# EAGLE design zcu-sync-control (EAGLE 7.4.0)
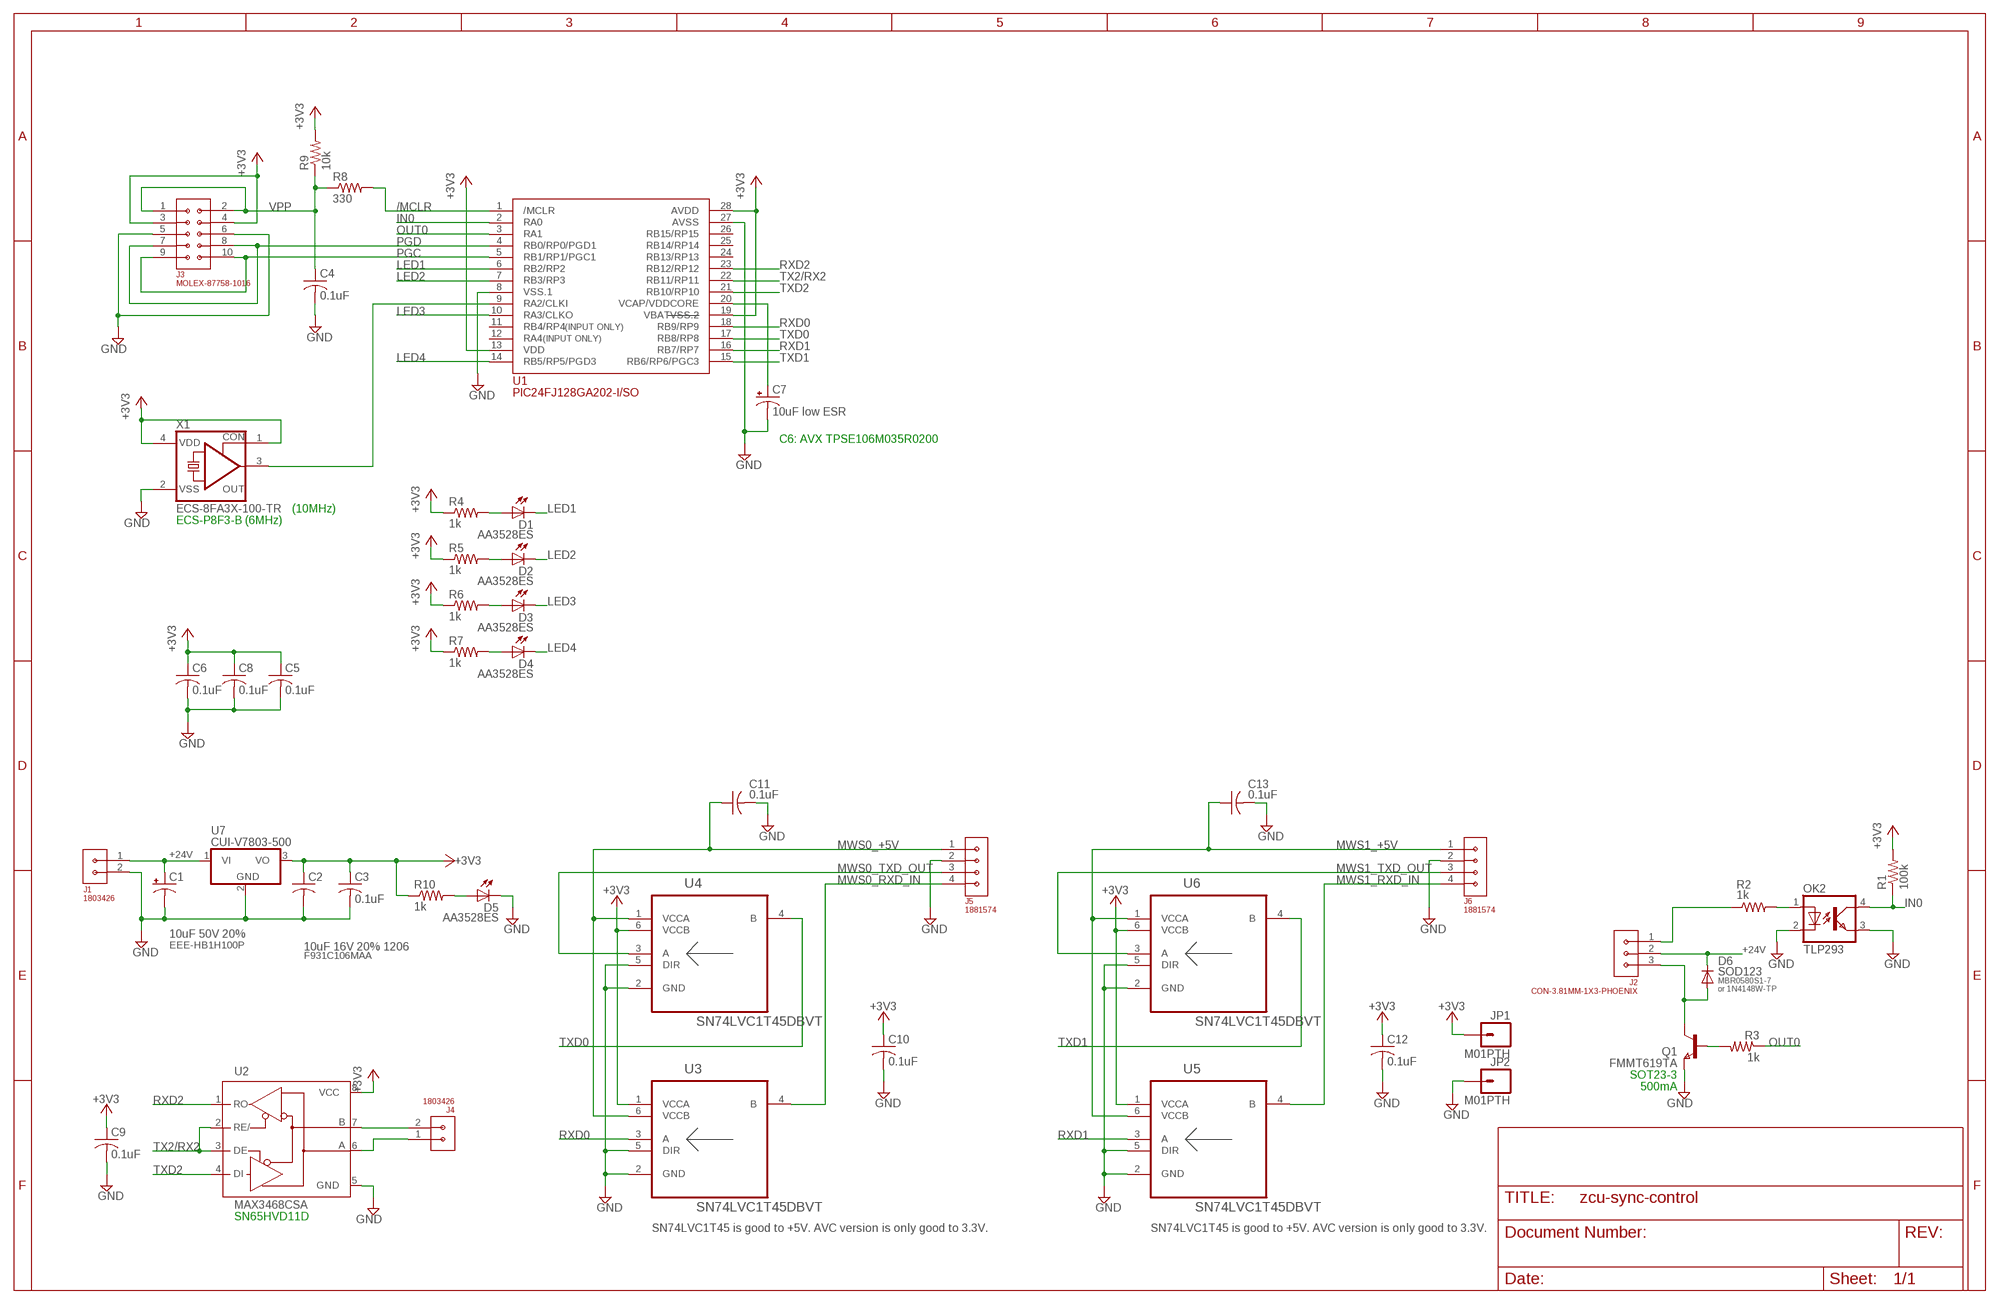
[diagram p0: schematic, sheet 1]

## Parts
C1  10uF 50V 20%  CPOL-USD  [PANASONIC_D]
C2  10uF 16V 20% 1206  C-USC1206  [C1206]
C3  0.1uF  C-USC1206  [C1206]
C4  0.1uF  C-USC1206  [C1206]
C5  0.1uF  C-USC1206  [C1206]
C6  0.1uF  C-USC1206  [C1206]
C7  10uF low ESR  CPOL-USD/7343-31R  [D/7343-31R]
C8  0.1uF  C-USC1206  [C1206]
C9  0.1uF  C-USC1206  [C1206]
C10  0.1uF  C-USC1206  [C1206]
C11  0.1uF  C-USC1206  [C1206]
C12  0.1uF  C-USC1206  [C1206]
C13  0.1uF  C-USC1206  [C1206]
D1  AA3528ES  LEDKA-3528ASYC  [KA-3528ASYC]
D2  AA3528ES  LEDKA-3528ASYC  [KA-3528ASYC]
D3  AA3528ES  LEDKA-3528ASYC  [KA-3528ASYC]
D4  AA3528ES  LEDKA-3528ASYC  [KA-3528ASYC]
D5  AA3528ES  LEDKA-3528ASYC  [KA-3528ASYC]
D6  1N4148W-TP  DIODE-SOD123  [SOD123]
J1  1803426  CON-3.81MM-1X2-PHOENIX-1803426  [CON-PHOENIX-1803426-3.81-1X2]
J2  CON-3.81MM-1X3-PHOENIX  [CON-PHOENIX-3.81-1X3]
J3  MOLEX-87758-1016  CON-2MM-2X5-MOLEX-87758-1016  [CON-2MM-2X5]
J4  1803426  CON-3.81MM-1X2-PHOENIX-1803426  [CON-PHOENIX-1803426-3.81-1X2]
J5  1881574  CON-2.5MM-1X4-PHOENIX-1881574  [CON-2.5MM-1X4-PHOENIX-1881574]
J6  1881574  CON-2.5MM-1X4-PHOENIX-1881574  [CON-2.5MM-1X4-PHOENIX-1881574]
JP1  M01PTH  [1X01]
JP2  M01PTH  [1X01]
OK2  TLP293  TLP283  [MINI-FLAT-4]
Q1  FMMT619TA  NPNSOT23  [SOT-23]
R1  100k  R-US_R1206  [R1206]
R2  1k  R-US_R1206  [R1206]
R3  1k  R-US_R1206  [R1206]
R4  1k  R-US_R1206  [R1206]
R5  1k  R-US_R1206  [R1206]
R6  1k  R-US_R1206  [R1206]
R7  1k  R-US_R1206  [R1206]
R8  330  R-US_R1206  [R1206]
R9  10k  R-US_R1206  [R1206]
R10  1k  R-US_R1206  [R1206]
U1  PIC24FJ128GA202-I/SO  PIC24HJ128GP202-I/SO  [SO28W]
U2  MAX3468CSA  [SO08]
U3  SN74LVC1T45DBVT  SN74AVC1T45DBVT  [SOT95P280X145-6N]
U4  SN74LVC1T45DBVT  SN74AVC1T45DBVT  [SOT95P280X145-6N]
U5  SN74LVC1T45DBVT  SN74AVC1T45DBVT  [SOT95P280X145-6N]
U6  SN74LVC1T45DBVT  SN74AVC1T45DBVT  [SOT95P280X145-6N]
U7  CUI-V7803-500  [CUI-78XX-500]
X1  ECS-8FA3X-100-TR  CRYSTAL_RES-1100S  [1100S]

## Nets
+3V3: C2.1 C3.1 C5.1 C6.1 C8.1 C9.1 C10.1 C12.1 J3.3 J3.4 JP1.1 R1.2 R4.1 R5.1 R6.1 R7.1 R9.2 R10.1 U1.13(VDD) U1.19(VSS.2) U1.28(AVDD) U2.8(VCC) U3.1(VCCA) U4.6(VCCB) U5.1(VCCA) U6.6(VCCB) U7.3(VO) X1.1(CON) X1.4(VDD)
+24V: C1.+ D6.C J1.1 J2.2 U7.1(VI)
/MCLR: R8.2 U1.1(/MCLR)
D+: J4.1 U2.6(A)
D-: J4.2 U2.7(B)
GND: C1.- C2.2 C3.2 C4.2 C5.2 C6.2 C7.- C8.2 C9.2 C10.2 C11.2 C12.2 C13.2 D5.C J1.2 J3.5 J3.6 J5.2 J6.2 JP2.1 OK2.2(C) OK2.3(EMIT) Q1.2(E) U1.8(VSS.1) U1.27(AVSS) U2.5(GND) U3.2(GND) U3.5(DIR) U4.2(GND) U4.5(DIR) U5.2(GND) U5.5(DIR) U6.2(GND) U6.5(DIR) U7.2(GND) X1.2(VSS)
IN0: OK2.4(COL) R1.1 U1.2(RA0)
LED1: D1.C U1.6(RB2/RP2)
LED2: D2.C U1.7(RB3/RP3)
LED3: D3.C U1.10(RA3/CLKO)
LED4: D4.C U1.14(RB5/RP5/PGD3)
MWS0_+5V: C11.1 J5.1 U3.6(VCCB) U4.1(VCCA)
MWS0_RXD_IN: J5.4 U3.4(B)
MWS0_TXD_OUT: J5.3 U4.3(A)
MWS1_+5V: C13.1 J6.1 U5.6(VCCB) U6.1(VCCA)
MWS1_RXD_IN: J6.4 U5.4(B)
MWS1_TXD_OUT: J6.3 U6.3(A)
N$1: U1.9(RA2/CLKI) X1.3(OUT)
N$3: D1.A R4.2
N$4: C7.+ U1.20(VCAP/VDDCORE)
N$6: D2.A R5.2
N$8: D3.A R6.2
N$10: OK2.1(A) R2.2
N$11: D4.A R7.2
N$13: J2.1 R2.1
N$14: D6.A J2.3 Q1.1(C)
N$16: Q1.3(B) R3.2
N$31: D5.A R10.2
OUT0: R3.1 U1.3(RA1)
PGC: J3.9 J3.10 U1.5(RB1/RP1/PGC1)
PGD: J3.7 J3.8 U1.4(RB0/RP0/PGD1)
RXD0: U1.18(RB9/RP9) U3.3(A)
RXD1: U1.16(RB7/RP7) U5.3(A)
RXD2: U1.23(RB12/RP12) U2.1(RO)
TX2/RX2: U1.22(RB11/RP11) U2.2(RE/) U2.3(DE)
TXD0: U1.17(RB8/RP8) U4.4(B)
TXD1: U1.15(RB6/RP6/PGC3) U6.4(B)
TXD2: U1.21(RB10/RP10) U2.4(DI)
VPP: C4.1 J3.1 J3.2 R8.1 R9.1
Unconnected: U1.11(RB4/RP4) U1.12(RA4) U1.24(RB13/RP13) U1.25(RB14/RP14) U1.26(RB15/RP15)

## Notes on the sheet
- VBAT
- (INPUT ONLY)
- (INPUT ONLY)
- C6: AVX TPSE106M035R0200
- (10MHz)
- ECS-P8F3-B (6MHz)
- EEE-HB1H100P
- F931C106MAA
- SOD123
- MBR0580S1-7
- or 1N4148W-TP
- SOT23-3
- 500mA
- SN65HVD11D
- SN74LVC1T45 is good to +5V. AVC version is only good to 3.3V. | SN74LVC1T45 is good to +5V. AVC version is only good to 3.3V.

## Library data of the parts
C1 C7 = rcl:CPOL-US: POLARIZED CAPACITOR, American symbol
C2-C6 C8-C13 = rcl:C-US: CAPACITOR, American symbol
D1-D5 = led:LED: LED OSRAM: - CHIPLED LG R971, LG N971, LY N971, LG Q971, LY Q971, LO R971, LY R971 LH N974, LH R974 LS Q976, LO Q976, LY Q976 LO Q996 - Hyper CHIPLED LW Q18S LB Q993, LB Q99A, LB R99A - SideLED LS A670, LO A670, LY A670, LG A670, LP A670 LB A673, LV A673, LT A673, LW A673 LH A674 LY A675 LS A676, LA A676, LO A676, LY A676, LW A676 LS A679, LY A679, LG A679 - Hyper Micro SIDELED® LS Y876, LA Y876, LO Y876, LY Y876 LT Y87S - SmartLED LW L88C, LW L88S LB L89C, LB L89S, LG L890 LS L89K, LO L89K, LY L89K LS L896, LA L896, LO L896, LY L896 - TOPLED LS T670, LO T670, LY T670, LG T670, LP T670 LSG T670, LSP T670, LSY T670, LOP T670, LYG T670 LG T671, LOG T671, LSG T671 LB T673, LV T673, LT T673, LW T673 LH T674 LS T676, LA T676, LO T676, LY T676, LB T676, LH T676, LSB T676, LW T676 LB T67C, LV T67C, LT T67C, LS T67K, LO T67K, LY T67K, LW E67C LS E67B, LA E67B, LO E67B, LY E67B, LB E67C, LV E67C, LT E67C LW T67C LS T679, LY T679, LG T679 LS T770, LO T770, LY T770, LG T770, LP T770 LB T773, LV T773, LT T773, LW T773 LH T774 LS E675, LA E675, LY E675, LS T675 LS T776, LA T776, LO T776, LY T776, LB T776 LHGB T686 LT T68C, LB T68C - Hyper Mini TOPLED® LB M676 - Mini TOPLED Santana® LG M470 LS M47K, LO M47K, LY M47K Source: http://www.osram.convergy.de LUXEON: - LUMILED® LXK2-PW12-R00, LXK2-PW12-S00, LXK2-PW14-U00, LXK2-PW14-V00 LXK2-PM12-R00, LXK2-PM12-S00, LXK2-PM14-U00 LXK2-PE12-Q00, LXK2-PE12-R00, LXK2-PE12-S00, LXK2-PE14-T00, LXK2-PE14-U00 LXK2-PB12-K00, LXK2-PB12-L00, LXK2-PB12-M00, LXK2-PB14-N00, LXK2-PB14-P00, LXK2-PB14-Q00 LXK2-PR12-L00, LXK2-PR12-M00, LXK2-PR14-Q00, LXK2-PR14-R00 LXK2-PD12-Q00, LXK2-PD12-R00, LXK2-PD12-S00 LXK2-PH12-R00, LXK2-PH12-S00 LXK2-PL12-P00, LXK2-PL12-Q00, LXK2-PL12-R00 Source: www.luxeon.com KINGBRIGHT: KA-3528ASYC Source: www.kingbright.com
D6 = diode:DIODE-: DIODE
J1 J4 = 0GlenConnectors:CON-3.81MM-1X2-PHOENIX-1803426
J2 = 0GlenConnectors:CON-3.81MM-1X3-PHOENIX
J3 = 0GlenConnectors:CON-2MM-2X5-MOLEX-87758-1016
J5 J6 = 0GlenConnectors:CON-2.5MM-1X4-PHOENIX-1881574
JP1 JP2 = SparkFun:M01: Header 1 Standard 1-pin 0.1" header. Use with straight break away headers (SKU : PRT-00116), right angle break away headers (PRT-00553), swiss pins (PRT-00743), machine pins (PRT-00117), and female headers (PRT-00115).
OK2 = optocoupler:TLP283: TOSHIBA PHOTOCOUPLER GaAs IRED & PHOTO-TRANSISTOR Source: http://www.semicon.toshiba.co.jp/td/en/Opto/Photocoupler/en_20050928_TLP283_datasheet.pdf; OC_FARNELL: unknown; OC_NEWARK: unknown
Q1 = zetex:NPNSOT23: NPN TRANSISTOR; MPN: DSS20201L-7; OC_FARNELL: 1710688; OC_NEWARK: 25R4555
R1-R10 = rcl:R-US_: RESISTOR, American symbol
U1 = GlenPartsLibrary:PIC24HJ128GP202-I/SO
U2 = maxim:MAX34*: +5V, Fail-Safe, 40Mbps, Profibus RS-485/RS-422 Transceivers Source: MAX3465-MAX3469.pdf; MPN: MAX3468CSA+; OC_FARNELL: unknown; OC_NEWARK: 76K6721
U3-U6 = Texas Instruments_By_element14_Batch_1:SN74AVC1T45DBVT: SINGLE-BIT DUAL-SUPPLY BUS TRANSCEIVER WITH CONFIGURABLE VOLTAGE TRANSLATION AND 3-STATE OUTPUTS; MPN: SN74AVC1T45DBVT; OC_FARNELL: 1053519; OC_NEWARK: 21J8968; PACKAGE: SOT-23-6; SUPPLIER: TEXAS INSTRUMENTS
U7 = GlenPartsLibrary:CUI-V7803-500
X1 = crystal:CRYSTAL_RES-: CRYSTAL RESONATOR; OC_FARNELL: unknown; OC_NEWARK: unknown

## Board
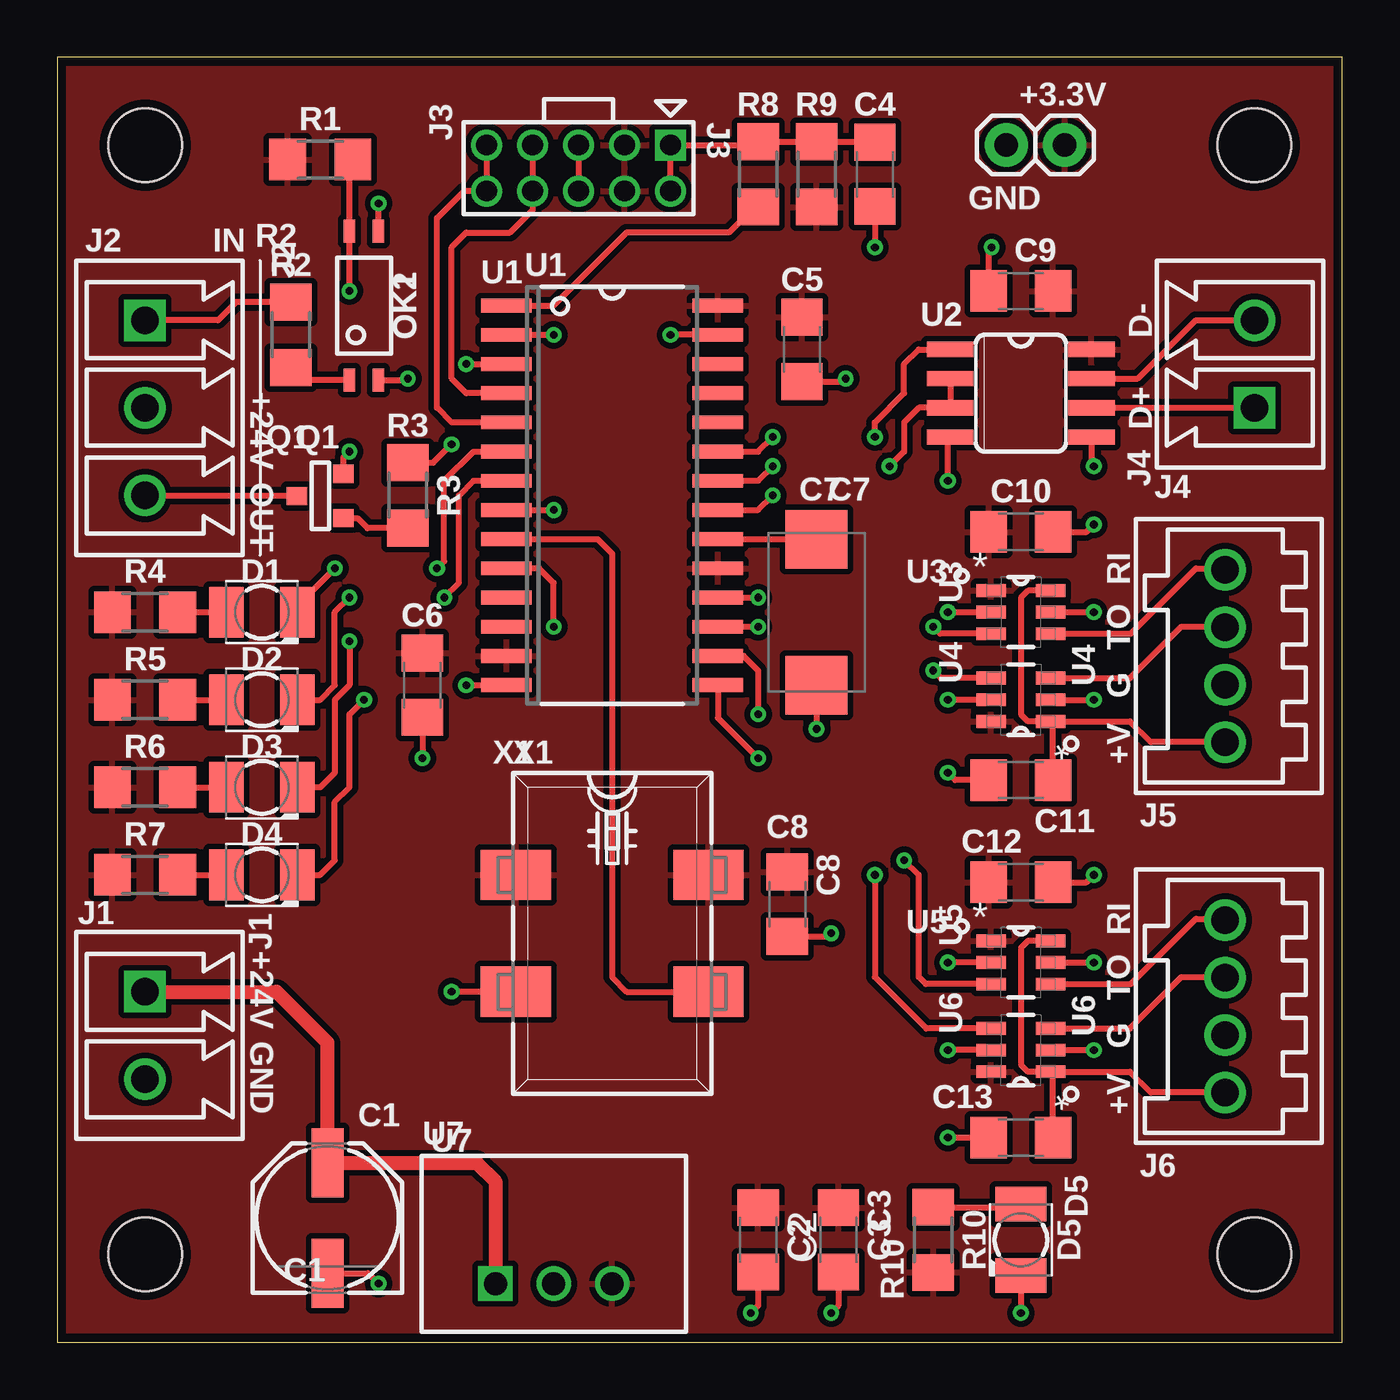
[diagram p1: board, top side]
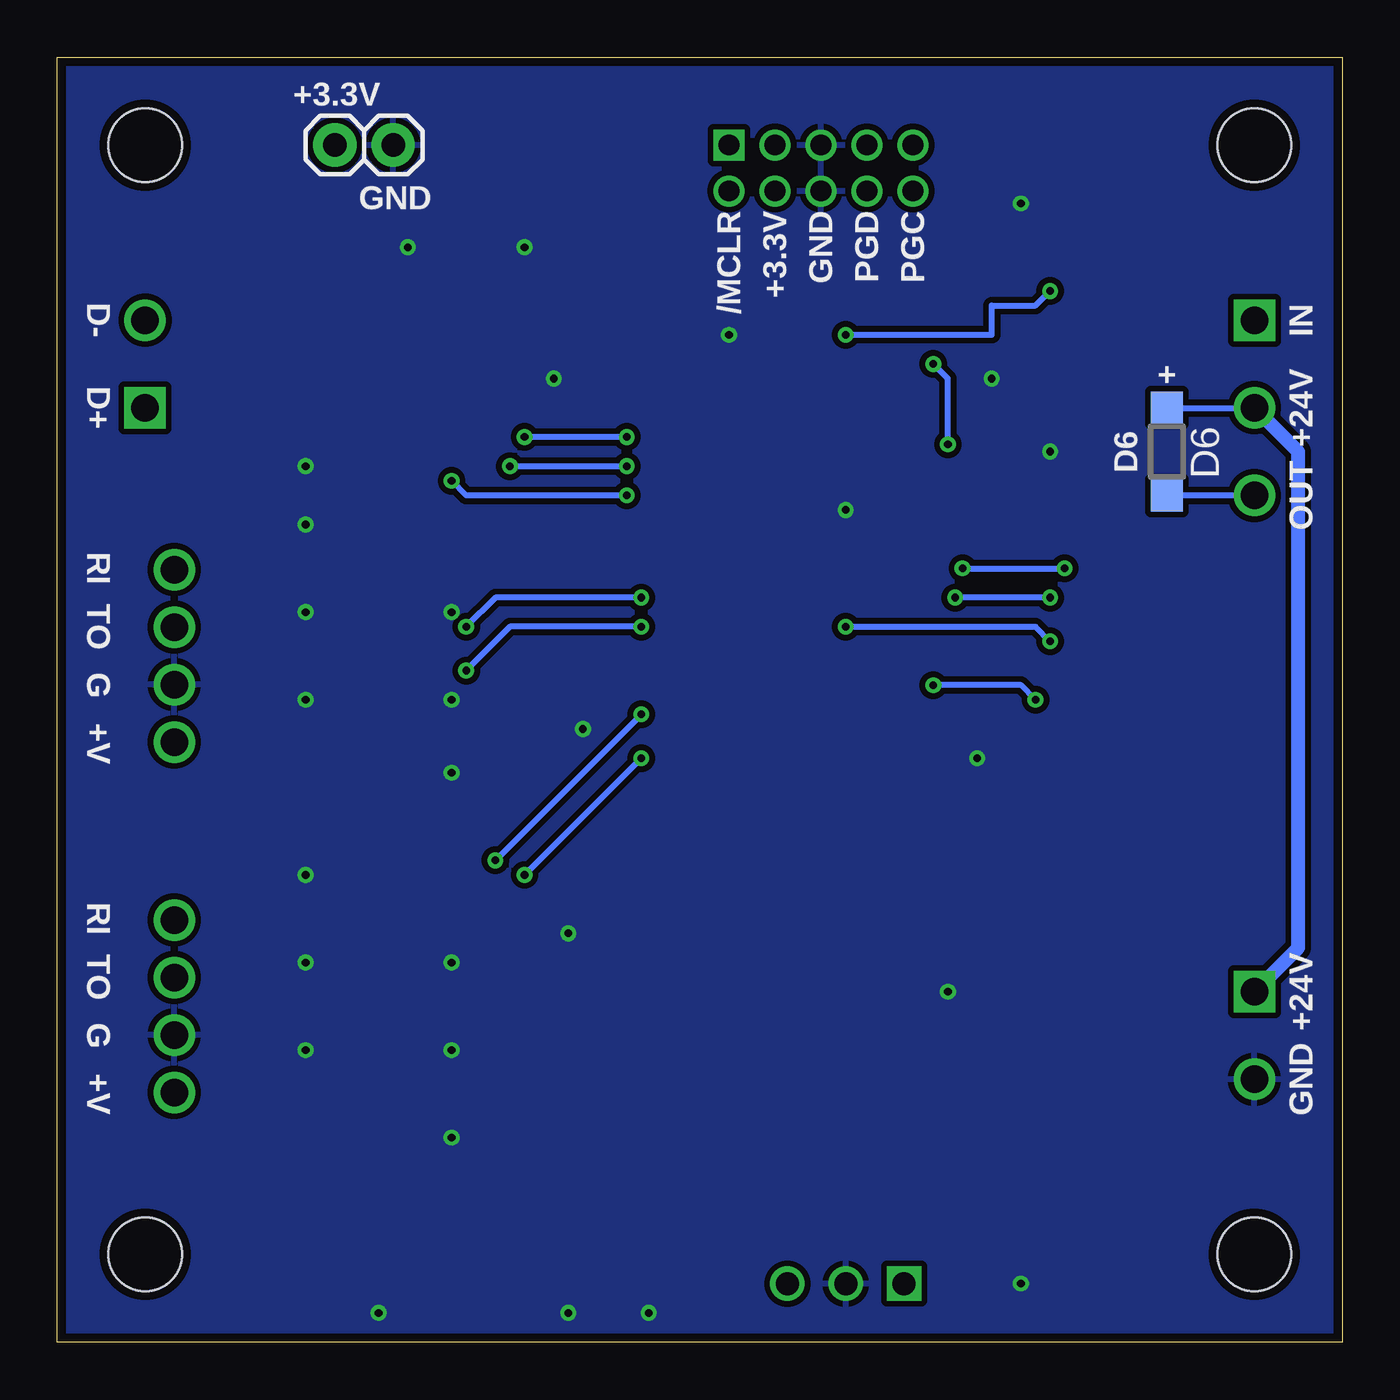
[diagram p2: board, bottom side, seen from below]

Size 55.88 x 55.88 mm. Coordinates in mm from the lower left corner, seen from the top.
Outline: 0,0 55.88,0 55.88,55.88 0,55.88 0,0
Copper layers (1*16): Top 0.0356mm / dielectric 1.5011mm / Bottom 0.0356mm
Design rules "oshpark-2layer": minimum track width 6mil, minimum drill 13mil, track to track 6mil, track to pad 6mil, pad to pad 6mil, via to via 6mil, smd to smd 6mil, copper to edge 15mil, drill to drill 6mil, minimum pad ring 7mil, minimum via ring 7mil, stop-mask expansion 2.5mil, vias tented up to drill 0mil, thermal gap 10mil
Holes 3.2 mm at 3.81,3.81 52.07,3.81 3.81,52.07 52.07,52.07

### Footprints (pad centres in the part's own frame; a part is rotated, then mirrored left to right if it is on the bottom)
PANASONIC_D = smd 3 x 1.4: + 2.4,0; - -2.4,0
C1206 = smd 1.6 x 1.8: 1 -1.4,0; 2 1.4,0
D/7343-31R = smd 2.55 x 2.7: + 3.175,0; - -3.175,0
KA-3528ASYC = smd 1.5 x 2.2: A -1.55,0; C 1.55,0
SOD123 = smd 1.4 x 1.4: A 1.9,0; C -1.9,0
CON-PHOENIX-1803426-3.81-1X2 = drill 1.2 square: 1 0,0 | drill 1.2: 2 3.81,0
CON-PHOENIX-3.81-1X3 = drill 1.2 square: 1 0,0 | drill 1.2: 2 3.81,0; 3 7.62,0
CON-2MM-2X5 = drill 0.9 pad 1.27 square: 1 0,0 | drill 0.9 pad 1.27: 2 2,0; 3 0,-2; 4 2,-2; 5 0,-4; 6 2,-4; 7 0,-6; 8 2,-6; 9 0,-8; 10 2,-8
CON-2.5MM-1X4-PHOENIX-1881574 = drill 1.2: 1 -3.75,0; 2 -1.25,0; 3 1.25,0; 4 3.75,0
1X01 = drill 1.016 pad 1.88: 1 0,0
MINI-FLAT-4 = smd 1 x 0.5: 1 -3.24,0.635; 2 -3.24,-0.635; 3 3.24,-0.635; 4 3.24,0.635
SOT-23 = smd 0.787 x 0.889: 1 0.025,-1.016; 2 -0.94,1.016; 3 0.991,1.016
R1206 = smd 1.6 x 1.803: 1 -1.422,0; 2 1.422,0
SO28W = smd 0.6 x 2.2: 1 -8.255,-4.6; 2 -6.985,-4.6; 3 -5.715,-4.6; 4 -4.445,-4.6; 5 -3.175,-4.6; 6 -1.905,-4.6; 7 -0.635,-4.6; 8 0.635,-4.6; 9 1.905,-4.6; 10 3.175,-4.6; 11 4.445,-4.6; 12 5.715,-4.6; 13 6.985,-4.6; 14 8.255,-4.6; 15 8.255,4.6; 16 6.985,4.6; 17 5.715,4.6; 18 4.445,4.6; 19 3.175,4.6; 20 1.905,4.6; 21 0.635,4.6; 22 -0.635,4.6; 23 -1.905,4.6; 24 -3.175,4.6; 25 -4.445,4.6; 26 -5.715,4.6; 27 -6.985,4.6; 28 -8.255,4.6
SO08 = smd 0.66 x 2.032: 1 -1.905,-3.073; 2 -0.635,-3.073; 3 0.635,-3.073; 4 1.905,-3.073; 5 1.905,3.073; 6 0.635,3.073; 7 -0.635,3.073; 8 -1.905,3.073
SOT95P280X145-6N = smd 1.27 x 0.559: 1 -1.295,0.94; 2 -1.295,0; 3 -1.295,-0.94; 4 1.295,-0.94; 5 1.295,0; 6 1.295,0.94
CUI-78XX-500 = drill 1 square: 1 0,0 | drill 1: 2 2.54,0; 3 5.08,0
1100S = smd 2.184 x 3.048: 1 -2.54,-4.191; 2 2.54,-4.191; 3 2.54,4.191; 4 -2.54,4.191

### Placement (x,y rotation side)
C1  11.75,5.4 90 top
C2  30.48,4.45 270 top
C3  33.97,4.45 270 top
C4  35.56,50.8 270 top
C5  32.38,43.18 270 top
C6  15.88,28.57 270 top
C7  33.02,31.75 90 top
C8  31.75,19.05 270 top
C9  41.91,45.72 180 top
C10  41.91,35.24 0 top
C11  41.91,24.45 180 top
C12  41.91,20 0 top
C13  41.91,8.89 180 top
D1  8.89,31.75 0 top
D2  8.89,27.94 0 top
D3  8.89,24.13 0 top
D4  8.89,20.32 0 top
D5  41.91,4.45 270 top
D6  7.62,38.73 270 bottom
J1  3.81,15.24 270 top
J2  3.81,44.45 270 top
J3  26.67,52.07 270 top
J4  52.07,40.64 90 top
J5  50.8,29.84 90 top
J6  50.8,14.61 90 top
JP1  43.81,52.07 0 top
JP2  41.27,52.07 0 top
OK2  13.34,45.09 90 top
Q1  11.43,36.83 270 top
R1  11.43,51.44 180 top
R2  10.16,43.81 270 top
R3  15.24,36.83 270 top
R4  3.81,31.75 0 top
R5  3.81,27.94 0 top
R6  3.81,24.13 0 top
R7  3.81,20.32 0 top
R8  30.48,50.8 270 top
R9  33.02,50.8 270 top
R10  38.1,4.45 90 top
U1  24.13,36.83 270 top
U2  41.91,41.27 270 top
U3  41.91,31.75 0 top
U4  41.91,27.94 180 top
U5  41.91,16.51 0 top
U6  41.91,12.7 180 top
U7  19.05,2.54 0 top
X1  24.13,17.78 270 top

### Tracks (layer width: path | path; a pad name or v marks a point on that pad's centre or on a via)
+3V3
  pour Top (isolate 0.254): 0,55.88 0,0 55.88,0 55.88,55.88
+24V
  Top 0.61: J1.1 9.53,15.24 11.75,13.02 C1.+ 18.24,7.8 19.05,6.99 U7.1
  Bottom 0.254: D6.C J2.2
  Bottom 0.61: J1.1 1.91,17.14 1.91,38.73 J2.2
/MCLR
  Top 0.254: U1.1 21.59,45.09 24.77,48.26 29.21,48.26 30.33,49.38 R8.2
D+
  Top 0.254: U2.6 J4.1
D-
  Top 0.254: U2.7 46.99,41.91 49.53,44.45 J4.2
GND  (via drill 0.33)
  Top 0.254: C10.2 44.77,35.24 v45.09,35.56 | U2.5 44.98,38.2 v45.09,38.1 | C9.2 40.51,47.49 v40.64,47.62 | C12.2 44.77,20 v45.09,20.32 | C11.2 39.05,24.45 v38.73,24.77 | U4.5 v38.73,27.94 | U4.2 v45.09,27.94 | U3.5 v45.09,31.75 | v38.73,31.75 U3.2 | C13.2 v38.73,8.89 | U6.5 v38.73,12.7 | U6.2 v45.09,12.7 | U5.5 v45.09,16.51 | U5.2 v38.73,16.51 | J3.5 J3.6 | C4.2 v35.56,47.62 | U1.27 v26.67,43.81 | C7.- v33.02,26.67 | U1.8 v21.59,36.2 | C5.2 34.16,41.78 v34.29,41.91 | X1.2 v17.14,15.24 | C8.2 33.52,17.65 v33.66,17.78 | C6.2 v15.88,25.4 | C1.- 13.51,3 v13.97,2.54 | C3.2 33.97,1.59 v33.66,1.27 | D5.C v41.91,1.27 | OK2.3 v13.97,49.53 | Q1.2 12.45,38.48 v12.7,38.73 | OK2.2 15.18,41.84 v15.24,41.91 | C2.2 30.48,1.59 v30.16,1.27
  pour Bottom (isolate 0.254): 0,55.88 55.88,55.88 55.88,0 0,0
IN0  (via drill 0.33)
  Top 0.254: R1.1 12.7,51.28 OK2.4 v12.7,45.72 | U1.2 v21.59,43.81
  Bottom 0.254: v21.59,43.81 15.24,43.81 15.24,45.09 13.34,45.09 v12.7,45.72
LED1  (via drill 0.33)
  Top 0.254: D1.C 10.44,32.03 v12.06,33.66 | v16.51,33.66 16.83,33.97 16.83,37.47 18.1,38.73 U1.6
  Bottom 0.254: v16.51,33.66 v12.06,33.66
LED2  (via drill 0.33)
  Top 0.254: D2.C 11.43,27.94 12.06,28.57 12.06,31.75 v12.7,32.38 | v16.83,32.38 17.46,33.02 17.46,36.83 18.1,37.47 U1.7
  Bottom 0.254: v12.7,32.38 v16.83,32.38
LED3  (via drill 0.33)
  Top 0.254: v12.7,30.48 12.7,28.57 12.06,27.94 12.06,24.77 11.43,24.13 D3.C | v21.59,31.11 21.59,33.02 20.95,33.66 U1.10
  Bottom 0.254: v21.59,31.11 13.34,31.11 v12.7,30.48
LED4  (via drill 0.33)
  Top 0.254: D4.C 11.43,20.32 12.06,20.95 12.06,23.5 12.7,24.13 12.7,27.3 v13.34,27.94 | v17.78,28.57 U1.14
  Bottom 0.254: v13.34,27.94 13.97,28.57 v17.78,28.57
MWS0_+5V
  Top 0.254: C11.1 43.31,26.9 U4.1 | U4.1 42.22,27 41.91,27.3 41.91,32.38 42.22,32.69 U3.6 | U4.1 46.66,27 47.56,26.09 J5.1
MWS0_RXD_IN
  Top 0.254: U3.4 46.69,30.81 49.53,33.66 50.74,33.66 J5.4
MWS0_TXD_OUT
  Top 0.254: U4.3 46.66,28.88 48.9,31.11 50.78,31.11 J5.3
MWS1_+5V
  Top 0.254: C13.1 43.31,11.66 U6.1 | U6.1 42.22,11.76 41.91,12.06 41.91,17.14 42.22,17.45 U5.6 | U6.1 46.66,11.76 47.56,10.86 J6.1
MWS1_RXD_IN
  Top 0.254: U5.4 46.69,15.57 49.53,18.41 50.74,18.41 J6.4
MWS1_TXD_OUT
  Top 0.254: U6.3 46.66,13.64 48.9,15.88 50.78,15.88 J6.3
N$1
  Top 0.254: U1.9 23.5,34.92 24.13,34.29 24.13,15.88 24.77,15.24 X1.3
N$3
  Top 0.254: R4.2 D1.A
N$4
  Top 0.254: U1.20 C7.+
N$6
  Top 0.254: R5.2 D2.A
N$8
  Top 0.254: R6.2 D3.A
N$10
  Top 0.254: OK2.1 10.71,41.84 R2.2
N$11
  Top 0.254: R7.2 D4.A
N$13
  Top 0.254: R2.1 7.77,45.24 6.99,44.45 J2.1
N$14
  Top 0.254: J2.3 10.39,36.83 Q1.1
  Bottom 0.254: J2.3 D6.A
N$16
  Top 0.254: Q1.3 13.06,35.84 13.49,35.41 R3.2
N$31
  Top 0.254: R10.2 41.78,5.87 D5.A
OUT0  (via drill 0.33)
  Top 0.254: R3.1 16.34,38.25 v17.14,39.05 | v17.78,42.55 U1.3
  Bottom 0.254: v17.14,39.05 17.14,41.91 v17.78,42.55
PGC
  Top 0.254: U1.5 17.14,40.01 16.51,40.64 16.51,48.9 17.68,50.07 J3.10 J3.9
PGD
  Top 0.254: U1.4 17.78,41.27 17.14,41.91 17.14,47.62 17.78,48.26 19.68,48.26 20.67,49.24 J3.8 J3.7
RXD0  (via drill 0.33)
  Top 0.254: U1.18 v30.48,32.38 | U3.3 38.41,30.81 v38.1,31.11
  Bottom 0.254: v30.48,32.38 36.83,32.38 v38.1,31.11
RXD1  (via drill 0.33)
  Top 0.254: U5.3 37.77,15.57 37.47,15.88 37.47,20.32 v36.83,20.95 | U1.16 29.84,29.84 30.48,29.21 v30.48,27.3
  Bottom 0.254: v36.83,20.95 v30.48,27.3
RXD2  (via drill 0.33)
  Top 0.254: U1.23 30.48,38.73 v31.11,39.37 | v35.56,39.37 35.56,40.01 36.83,41.27 36.83,42.55 37.47,43.18 U2.1
  Bottom 0.254: v31.11,39.37 v35.56,39.37
TX2/RX2  (via drill 0.33)
  Top 0.254: U2.2 U2.3 37.47,40.64 36.83,40.01 36.83,38.73 v36.2,38.1 | U1.22 30.48,37.47 v31.11,38.1
  Bottom 0.254: v36.2,38.1 v31.11,38.1
TXD0  (via drill 0.33)
  Top 0.254: U1.17 v30.48,31.11 | U4.4 38.43,28.88 v38.1,29.21
  Bottom 0.254: v30.48,31.11 36.2,31.11 v38.1,29.21
TXD1  (via drill 0.33)
  Top 0.254: U1.15 28.73,27.15 v30.48,25.4 | v35.56,20.32 35.56,15.88 37.8,13.64 U6.4
  Bottom 0.254: v30.48,25.4 v35.56,20.32
TXD2  (via drill 0.33)
  Top 0.254: U1.21 30.48,36.2 v31.11,36.83 | v38.73,37.47 38.73,39.27 U2.4
  Bottom 0.254: v31.11,36.83 38.1,36.83 v38.73,37.47
VPP
  Top 0.254: J3.2 J3.1 30.33,52.07 R8.1 R9.1 35.54,52.22 C4.1

### Text on the board
_tsilk: +3.3V | R1 | J3 | R8 | R9 | C4 | GND | J2 | IN | C9 | R2 | U1 | C5 | OK1 | U2 | D- | +24V | D+ | Q1 | R3 | J4 | C7 | C10 | OUT | RI | R4 | D1 | U3 | C6 | TO | R5 | D2 | U4 | G | +V | R6 | D3 | X1 | C11 | J5 | R7 | D4 | C8 | C12 | J1 | U5 | RI | TO | +24V | U6 | G | GND | +V | C13 | C1 | U7 | J6 | C2 | C3 | R10 | D5
_bsilk: +3.3V | GND | PGC | PGD | GND | +3.3V | /MCLR | IN | D- | + | +24V | D+ | D6 | OUT | RI | TO | G | +V | RI | TO | +24V | G | GND | +V